# Altium schematic sheet AnalogOut.SchDoc
size 420 x 297 mm; Обозначение документа: QFP analogOut; Номер листа: 9; Общее количество листов: 10
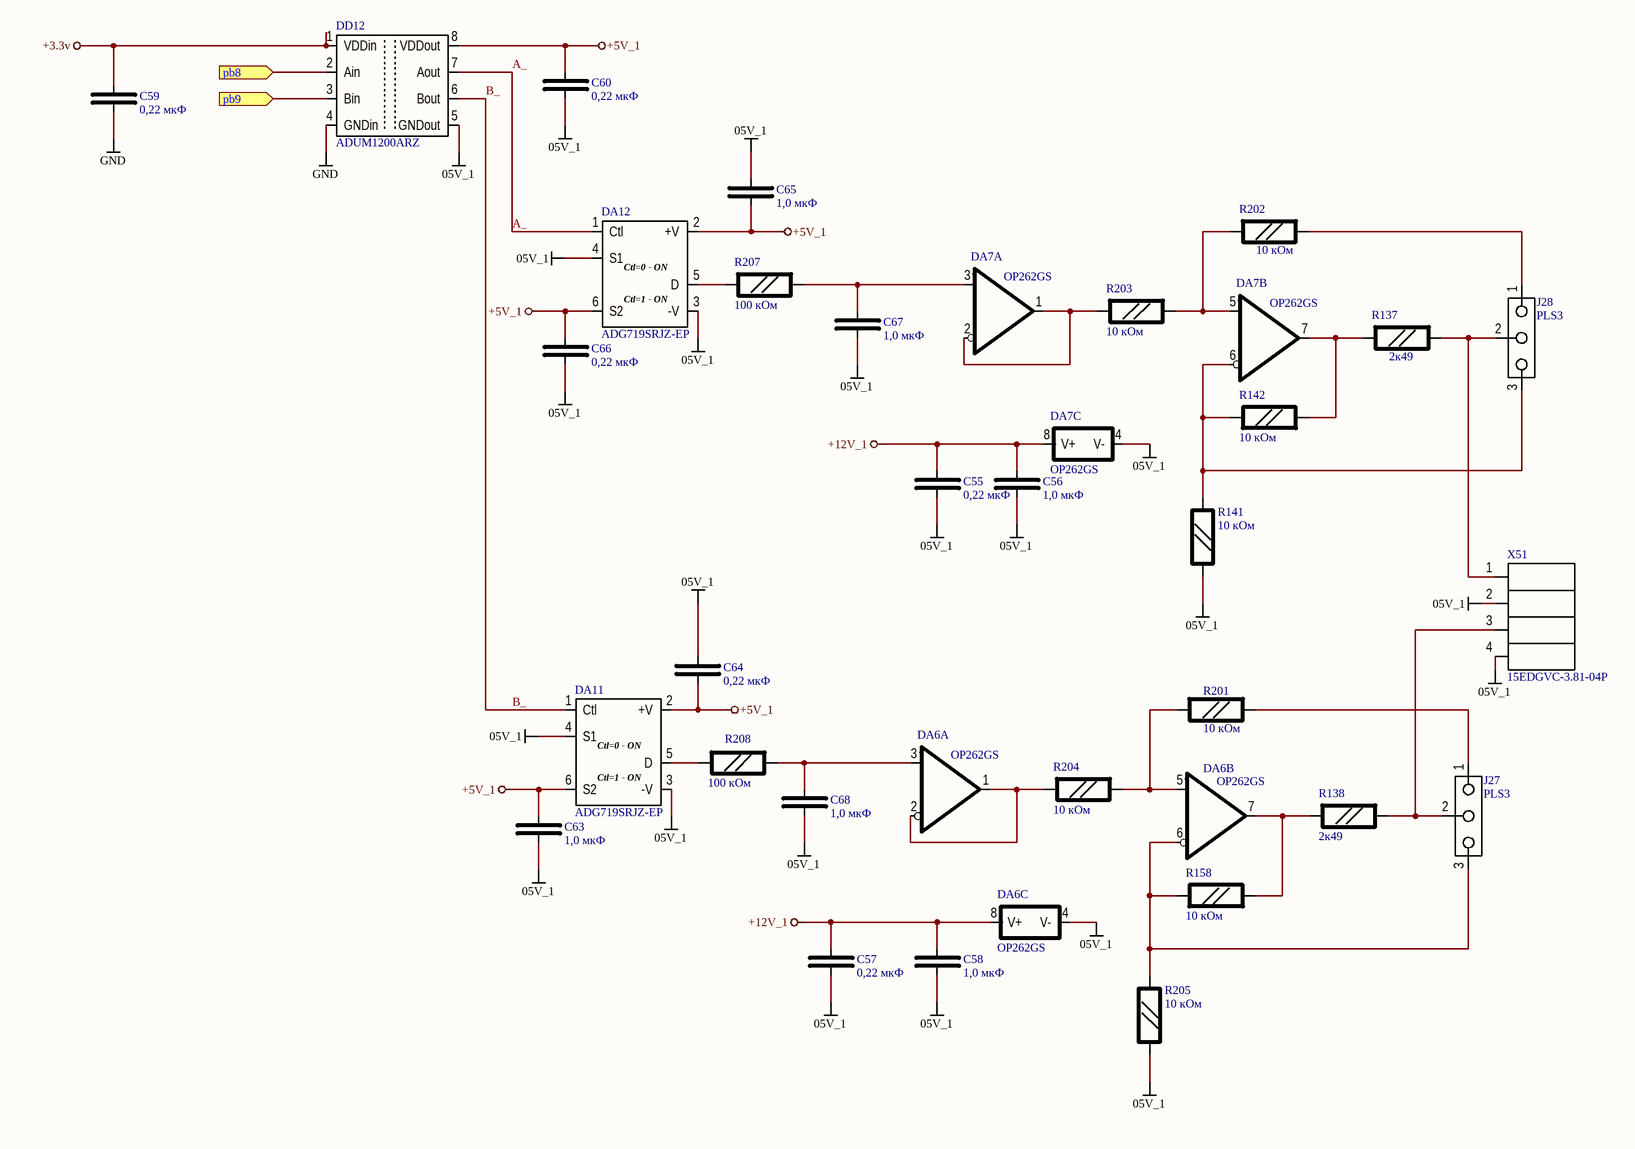
[diagram p0: AnalogOut.SchDoc]

## Parts
C55  0,22 мкФ  [SMD0805CAP]
C56  1,0 мкФ  [SMD0805CAP]
C57  0,22 мкФ  [SMD0805CAP]
C58  1,0 мкФ  [SMD0805CAP]
C59  0,22 мкФ  [SMD0805CAP]
C60  0,22 мкФ  [SMD0805CAP]
C63  1,0 мкФ  [SMD0805CAP]
C64  0,22 мкФ  [SMD0805CAP]
C65  1,0 мкФ  [SMD0805CAP]
C66  0,22 мкФ  [SMD0805CAP]
C67  1,0 мкФ  [SMD0805CAP]
C68  1,0 мкФ  [SMD0805CAP]
DA6  OP262GS  [SO8]  (parts A,B,C of 3)
DA7  OP262GS  [SO8]  (parts A,B,C of 3)
DA11  ADG719SRJZ-EP  [SOT23-6]
DA12  ADG719SRJZ-EP  [SOT23-6]
DD12  ADUM1200ARZ  [SO8]
J27  PLS3  [HDR1X3]
J28  PLS3  [HDR1X3]
R137  2к49  [SMD0805RES]
R138  2к49  [SMD0805RES]
R141  10 кОм  [SMD0805RES]
R142  10 кОм  [SMD0805RES]
R158  10 кОм  [SMD0805RES]
R201  10 кОм  [SMD0805RES]
R202  10 кОм  [SMD0805RES]
R203  10 кОм  [SMD0805RES]
R204  10 кОм  [SMD0805RES]
R205  10 кОм  [SMD0805RES]
R207  100 кОм  [SMD0805RES]
R208  100 кОм  [SMD0805RES]
X51  15EDGVC-3.81-04P  [15EDGVC_081_4]

## Ports
pb8 (in), pb9 (in)

## Nets
05V_1: C55.2 C56.2 C57.2 C58.2 C60.2 C63.2 C64.2 C65.2 C66.2 C67.2 C68.2 DA6.4(V-) DA7.4(V-) DA11.3(-V) DA11.4(S1) DA12.3(-V) DA12.4(S1) DD12.5(GNDout) R141.1 R205.1 X51.2 X51.4
+3.3v: C59.1 DD12.1(VDDin)
+5V_1: C60.1 C63.1 C64.1 C65.1 C66.1 DA11.2(+V) DA11.6(S2) DA12.2(+V) DA12.6(S2) DD12.8(VDDout)
+12V_1: C55.1 C56.1 C57.1 C58.1 DA6.8(V+) DA7.8(V+)
GND: C59.2 DD12.4(GNDin)
A_: DA12.1(Ctl) DD12.7(Aout)
B_: DA11.1(Ctl) DD12.6(Bout)
pb8: DD12.2(Ain) ; port pb8
pb9: DD12.3(Bin) ; port pb9
NetC67_1: C67.1 DA7.3(+) R207.2
NetC68_1: C68.1 DA6.3(+) R208.2
NetDA6_1: DA6.1(OUT) DA6.2(-) R204.1
NetDA6_5: DA6.5(+) R201.1 R204.2
NetDA6_6: DA6.6(-) J27.3(Left) R158.2 R205.2
NetDA6_7: DA6.7(OUT) R138.1 R158.1
NetDA7_1: DA7.1(OUT) DA7.2(-) R203.1
NetDA7_5: DA7.5(+) R202.1 R203.2
NetDA7_6: DA7.6(-) J28.3(Left) R141.2 R142.2
NetDA7_7: DA7.7(OUT) R137.1 R142.1
NetDA11_5: DA11.5(D) R208.1
NetDA12_5: DA12.5(D) R207.1
NetJ27_1: J27.1(Right) R201.2
NetJ27_2: J27.2(Cetnter) R138.2 X51.3
NetJ28_1: J28.1(Right) R202.2
NetJ28_2: J28.2(Cetnter) R137.2 X51.1

## Notes on the sheet
- Подп. и дата
- Инв. № дубл.
- Взам. инв. №
- Инв. № подл.
- Изм.
- Лист
- № докум.
- Подп.
- Дата
- Копировал
- Формат А3
- (in symbol ADG719BRJ) Ctl=0 - ON; Ctl=1 - ON

## Library data of the parts
C55-C60 C63-C68 = C0805: Чип конденсатор 0805; Voltage: 50V; Vendor: Generic; Temp: Y5V; Tol: 20%; SolderOpton: Norm; Price: 2
  C55 C57 C59 C60 C64 C66: Value: 0,22 мкФ
  C56 C58 C63 C65 C67 C68: Value: 1,0 мкФ
DA6 DA7 = OP262GS: ОУ сдвоенный R2R out; Vendor: Analog Devices; Voltage: 2.7..12V; Bandwidth: 15MHz; SolderOption: Norm; Value: OP262GS; Price: 400
DA11 DA12 = ADG719BRJ: аналоговый ключ SPDT; Vendor: Anlog Devices; Voltage: 1V8.. 5V5; SolderOption: Norm; Value: ADG719SRJZ-EP; Price: 500
DD12 = ADUM1200ARZ: 2х канальный цифровой изолятор; Vendor: Analog Devices; Voltage: 3..5V; SolderOpton: Norm; Value: ADUM1200ARZ; Price: 750
J27 J28 = PLS3: Джампер PLS3 2.54мм; SolderOption: Norm; Price: 1; Vendor: *; Value: PLS3
R137 R138 R141 R142 R158 R201-R205 = R0805: Чип резистор 0805; Vendor: Generic; Tolerance: 1%; SolderOpton: Norm; Price: 2
  R137 R138: Value: 2к49
  R141 R142 R158 R201-R205: Value: 10 кОм
R207 R208 = R0805: Чип резистор 0805; Vendor: Generic; Tolerance: 5%; SolderOpton: Norm; Price: 2; Value: 100 кОм
X51 = 15EDGVC-3.81-04P: Вилка  4/3.81; Vendor: Degson; Current: 8А; Voltage: 2кВ; Price: 25; Value: 15EDGVC-3.81-04P